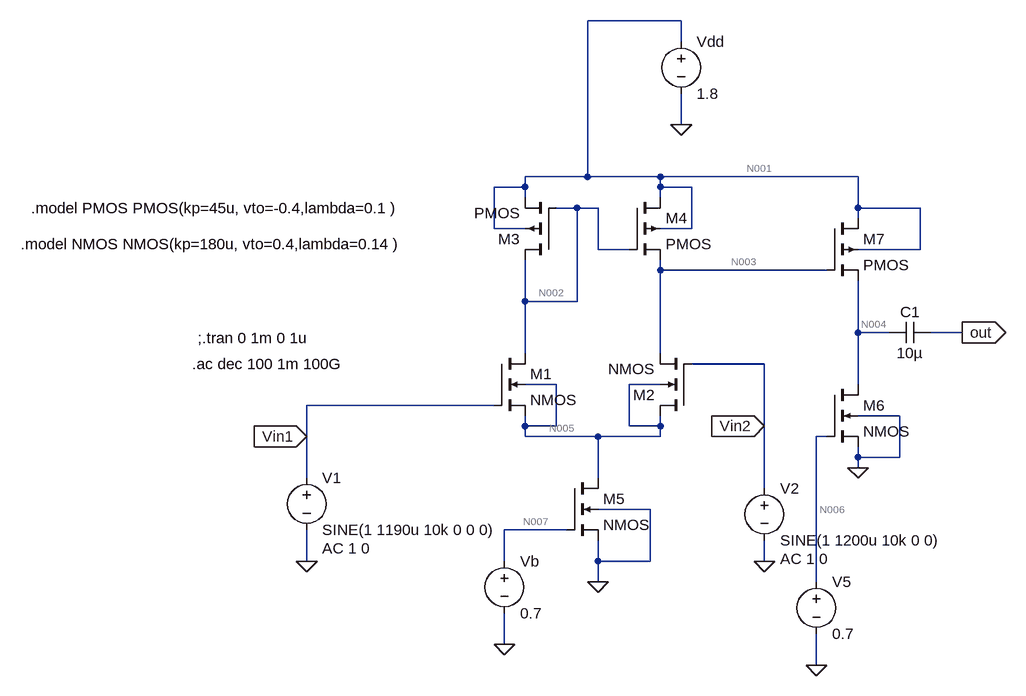
[diagram p0: schematic exp10.asc]
exp10.asc, the LTspice schematic file:
Version 4
SHEET 1 880 824
WIRE 288 -208 144 -208
WIRE 288 -176 288 -208
WIRE 288 -48 288 -96
WIRE 144 32 144 -208
WIRE 144 32 48 32
WIRE 256 32 144 32
WIRE 560 32 256 32
WIRE 48 48 48 32
WIRE 48 48 0 48
WIRE 256 48 256 32
WIRE 304 48 256 48
WIRE 48 64 48 48
WIRE 256 64 256 48
WIRE 128 80 96 80
WIRE 160 80 128 80
WIRE 560 80 560 32
WIRE 656 80 560 80
WIRE 560 96 560 80
WIRE 0 112 0 48
WIRE 48 112 0 112
WIRE 304 112 304 48
WIRE 304 112 256 112
WIRE 160 144 160 80
WIRE 208 144 160 144
WIRE 656 144 656 80
WIRE 656 144 560 144
WIRE 256 176 256 160
WIRE 512 176 256 176
WIRE 48 224 48 160
WIRE 128 224 128 80
WIRE 128 224 48 224
WIRE 560 272 560 192
WIRE 608 272 560 272
WIRE 720 272 672 272
WIRE 48 304 48 224
WIRE 256 304 256 176
WIRE 416 320 304 320
WIRE 96 352 48 352
WIRE 256 352 208 352
WIRE 560 352 560 272
WIRE 0 384 -288 384
WIRE 624 400 560 400
WIRE 48 416 48 400
WIRE 96 416 96 352
WIRE 96 416 48 416
WIRE 208 416 208 352
WIRE 256 416 256 400
WIRE 256 416 208 416
WIRE 416 416 416 320
WIRE -288 432 -288 384
WIRE 48 432 48 416
WIRE 160 432 48 432
WIRE 256 432 256 416
WIRE 256 432 160 432
WIRE 512 432 496 432
WIRE 560 464 560 448
WIRE 624 464 624 400
WIRE 624 464 560 464
WIRE 560 480 560 464
WIRE -288 496 -288 432
WIRE 160 496 160 432
WIRE 416 512 416 416
WIRE 240 544 160 544
WIRE 112 576 16 576
WIRE -288 624 -288 576
WIRE 16 624 16 576
WIRE 160 624 160 592
WIRE 240 624 240 544
WIRE 240 624 160 624
WIRE 416 624 416 592
WIRE 160 656 160 624
WIRE 496 656 496 432
WIRE 16 752 16 704
WIRE 496 784 496 736
FLAG 160 656 0
FLAG 560 480 0
FLAG -288 624 0
FLAG 416 624 0
FLAG 720 272 out
IOPIN 720 272 Out
FLAG 288 -48 0
FLAG 496 784 0
FLAG 16 752 0
FLAG -288 432 Vin1
IOPIN -288 432 In
FLAG 416 416 Vin2
IOPIN 416 416 In
SYMBOL pmos4 96 160 R180
SYMATTR InstName M3
SYMATTR Value2 l=0.8u w=10.24u
SYMBOL pmos4 208 64 R0
SYMATTR InstName M4
SYMATTR Value2 l=0.8u w=10.24u
SYMBOL nmos4 0 304 R0
SYMATTR InstName M1
SYMATTR Value2 l=0.8u w=5.76u
SYMBOL nmos4 304 400 R180
SYMATTR InstName M2
SYMATTR Value2 l=0.8u w=5.76u
SYMBOL nmos4 112 496 R0
SYMATTR InstName M5
SYMATTR Value2 l=0.8u w=9.87u
SYMBOL pmos4 512 96 R0
SYMATTR InstName M7
SYMATTR Value2 l=0.8u w=20.48u
SYMBOL nmos4 512 352 R0
SYMATTR InstName M6
SYMATTR Value2 l=0.8u w=9.87u
SYMBOL voltage -288 480 R0
WINDOW 123 24 124 Left 2
WINDOW 39 0 0 Left 0
SYMATTR Value2 AC 1 0
SYMATTR InstName V1
SYMATTR Value SINE(1 1190u 10k 0 0 0)
SYMBOL voltage 416 496 R0
WINDOW 123 24 124 Left 2
WINDOW 39 0 0 Left 0
SYMATTR Value2 AC 1 0
SYMATTR InstName V2
SYMATTR Value SINE(1 1200u 10k 0 0)
SYMBOL voltage 288 -192 R0
WINDOW 123 0 0 Left 0
WINDOW 39 0 0 Left 0
SYMATTR InstName Vdd
SYMATTR Value 1.8
SYMBOL voltage 16 608 R0
WINDOW 123 0 0 Left 0
WINDOW 39 0 0 Left 0
SYMATTR InstName Vb
SYMATTR Value 0.7
SYMBOL voltage 496 640 R0
WINDOW 123 0 0 Left 0
WINDOW 39 0 0 Left 0
SYMATTR InstName V5
SYMATTR Value 0.7
SYMBOL cap 672 256 R90
WINDOW 0 0 32 VBottom 2
WINDOW 3 32 32 VTop 2
SYMATTR InstName C1
SYMATTR Value 10µ
TEXT -712 80 Left 2 !.model PMOS PMOS(kp=45u, vto=-0.4,lambda=0.1 )
TEXT -728 136 Left 2 !.model NMOS NMOS(kp=180u, vto=0.4,lambda=0.14 )
TEXT -456 280 Left 2 !;.tran 0 1m 0 1u
TEXT -464 320 Left 2 !.ac dec 100 1m 100G

The netlist it stands for:
* exp10.asc
M3 N002 N002 N001 N001 PMOS l=0.8u w=10.24u
M4 N001 N002 N003 N001 PMOS l=0.8u w=10.24u
M1 N002 Vin1 N005 N005 NMOS l=0.8u w=5.76u
M2 N005 Vin2 N003 N005 NMOS l=0.8u w=5.76u
M5 N005 N007 0 0 NMOS l=0.8u w=9.87u
M7 N001 N003 N004 N001 PMOS l=0.8u w=20.48u
M6 N004 N006 0 0 NMOS l=0.8u w=9.87u
V1 Vin1 0 SINE(1 1190u 10k 0 0 0) AC 1 0
V2 Vin2 0 SINE(1 1200u 10k 0 0) AC 1 0
Vdd N001 0 1.8
Vb N007 0 0.7
V5 N006 0 0.7
C1 out N004 10µ
.model NMOS NMOS
.model PMOS PMOS
.lib standard.mos
.model PMOS PMOS(kp=45u, vto=-0.4,lambda=0.1 )
.model NMOS NMOS(kp=180u, vto=0.4,lambda=0.14 )
;.tran 0 1m 0 1u
.ac dec 100 1m 100G
.backanno
.end

* Results of the author's LTspice run, read from the files saved beside the schematic
* Operating Point, zero values left out:
*   V(n002) = 990.3 mV
*   V(n001) = 1.8 V
*   V(n003) = 990.3 mV
*   V(vin1) = 1 V
*   V(n005) = 328.3 mV
*   V(vin2) = 1 V
*   V(n007) = 700 mV
*   V(n004) = 598.8 mV
*   V(n006) = 700 mV
*   V(out) = 5.988 µV
*   Id(M6) = 108.3 µA
*   Is(M6) = -108.3 µA
*   Id(M5) = 104.5 µA
*   Is(M5) = -104.5 µA
*   Id(M2) = -52.26 µA
*   Is(M2) = 52.26 µA
*   Id(M1) = 52.26 µA
*   Is(M1) = -52.26 µA
*   Id(M7) = 108.3 µA
*   Ib(M7) = 1.211 pA
*   Is(M7) = -108.3 µA
*   Id(M4) = 52.26 µA
*   Is(M4) = -52.26 µA
*   Id(M3) = -52.26 µA
*   Is(M3) = 52.26 µA
*   I(Vdd) = -212.8 µA